# Altium schematic sheet 8_BTB.schdoc
size 210 x 148 mm; Symbol: tv_muban1_1; Company: 嘉立创EDA; Version: V1.0; Page Size: A4; @Project Name: LCEDAsucaiku; @Update Date: 2026-05-01; @Create Date: 2026-03-27; @Page Name: BTB; @Page Count: 8; @Page No: 8; @Update Time: 18:58:41; Color: #990000; Device: sucai_muban; @Board Name: tv基板; @Create Time: 22:25:07; @Schematic Name: Schematic1; @Assembly Variant: Basic; Border: 1; Title Block Position: 3; Size: A4; Width: 826; Height: 582; Region Start: 1; X Region Count: 6; Y Region Count: 4; Blade Width: 10; SheetNumber: 8; SheetTotal: 8
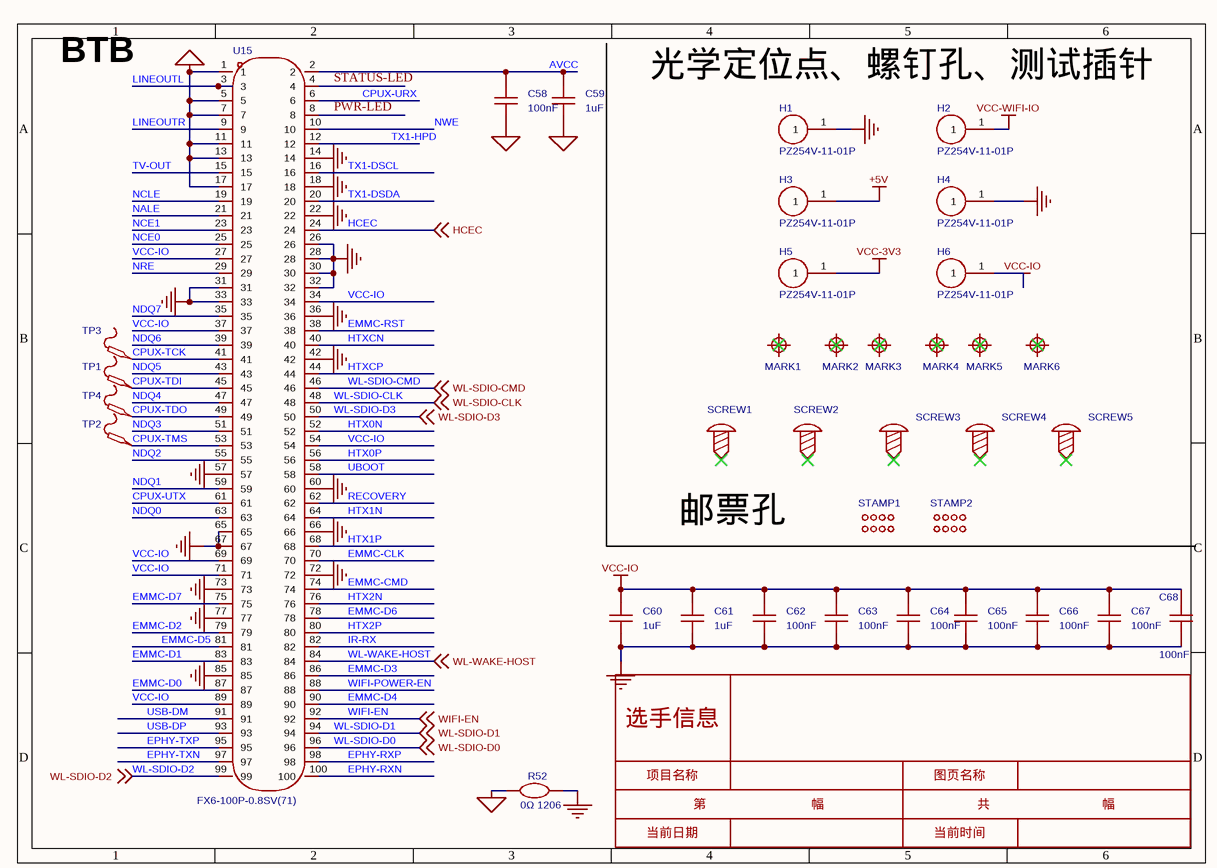
[diagram p0: 8_BTB.schdoc]

## Parts
C58  100nF  [C0402]
C59  1uF  [C0402]
C60  1uF  [C0402]
C61  1uF  [C0402]
C62  100nF  [C0402]
C63  100nF  [C0402]
C64  100nF  [C0402]
C65  100nF  [C0402]
C66  100nF  [C0402]
C67  100nF  [C0402]
C68  100nF  [C0402]
H1  PZ254V-11-01P  [HDR-TH_1P-P2.54-V-M]
H2  PZ254V-11-01P  [HDR-TH_1P-P2.54-V-M]
H3  PZ254V-11-01P  [HDR-TH_1P-P2.54-V-M]
H4  PZ254V-11-01P  [HDR-TH_1P-P2.54-V-M]
H5  PZ254V-11-01P  [HDR-TH_1P-P2.54-V-M]
H6  PZ254V-11-01P  [HDR-TH_1P-P2.54-V-M]
MARK1  (no value)  [Mark-Point-1mm]
MARK2  (no value)  [Mark-Point-1mm]
MARK3  (no value)  [Mark-Point-1mm]
MARK4  (no value)  [Mark-Point-1mm]
MARK5  (no value)  [Mark-Point-1mm]
MARK6  (no value)  [Mark-Point-1mm]
R52  0Ω 1206  [R1206]
SCREW1  (no value)  [SIP-1A]
SCREW2  (no value)  [SIP-1A]
SCREW3  (no value)  [SIP-1A]
SCREW4  (no value)  [SIP-1A]
SCREW5  (no value)  [SIP-1A]
STAMP1  (no value)  [youpiaokong]
STAMP2  (no value)  [youpiaokong]
TP1  (no value)  [Test-Point-0.5mm]
TP2  (no value)  [Test-Point-0.5mm]
TP3  (no value)  [Test-Point-0.5mm]
TP4  (no value)  [Test-Point-0.5mm]
U15  FX6-100P-0.8SV(71)  [CONN-SMD_100P-P0.80_FX6-100P-0.8SV71]

## Nets
+5V: H3.1
AGND: C58.2 C59.2 R52.1 U15.1 U15.5 U15.7 U15.11 U15.13 U15.17
GND: C60.2 C61.2 C62.2 C63.2 C64.2 C65.2 C66.2 C67.2 C68.2 H1.1 H4.1 R52.2 U15.14 U15.18 U15.22 U15.26 U15.28 U15.30 U15.31 U15.32 U15.33 U15.36 U15.42 U15.57 U15.60 U15.65 U15.66 U15.67 U15.72 U15.73 U15.77 U15.85
VCC-3V3: H5.1
VCC-IO: C60.1 C61.1 C62.1 C63.1 C64.1 C65.1 C66.1 C67.1 C68.1 H6.1 U15.27 U15.34 U15.37 U15.54 U15.69 U15.71 U15.89
VCC-WIFI-IO: H2.1
AVCC: C58.1 C59.1 U15.2
CPUX-TCK: TP3.1 U15.41
CPUX-TDI: TP1.1 U15.45
CPUX-TDO: TP4.1 U15.49
CPUX-TMS: TP2.1 U15.53
CPUX-URX: U15.6
CPUX-UTX: U15.61
EMMC-CLK: U15.70
EMMC-CMD: U15.74
EMMC-D0: U15.87
EMMC-D1: U15.83
EMMC-D2: U15.79
EMMC-D3: U15.86
EMMC-D4: U15.90
EMMC-D5: U15.81
EMMC-D6: U15.78
EMMC-D7: U15.75
EMMC-RST: U15.38
EPHY-RXN: U15.100
EPHY-RXP: U15.98
EPHY-TXN: U15.97
EPHY-TXP: U15.95
HCEC: U15.24 ; off-sheet HCEC
HTX0N: U15.52
HTX0P: U15.56
HTX1N: U15.64
HTX1P: U15.68
HTX2N: U15.76
HTX2P: U15.80
HTXCN: U15.40
HTXCP: U15.44
IR-RX: U15.82
LINEOUTL: U15.3
LINEOUTR: U15.9
NALE: U15.21
NCE0: U15.25
NCE1: U15.23
NCLE: U15.19
NDQ0: U15.63
NDQ1: U15.59
NDQ2: U15.55
NDQ3: U15.51
NDQ4: U15.47
NDQ5: U15.43
NDQ6: U15.39
NDQ7: U15.35
NRE: U15.29
NWE: U15.10
PWR-LED: U15.8
RECOVERY: U15.62
STATUS-LED: U15.4
TV-OUT: U15.15
TX1-DSCL: U15.16
TX1-DSDA: U15.20
TX1-HPD: U15.12
UBOOT: U15.58
USB-DM: U15.91
USB-DP: U15.93
WIFI-EN: U15.92 ; off-sheet WIFI-EN
WIFI-POWER-EN: U15.88
WL-SDIO-CLK: U15.48 ; off-sheet WL-SDIO-CLK
WL-SDIO-CMD: U15.46 ; off-sheet WL-SDIO-CMD
WL-SDIO-D0: U15.96 ; off-sheet WL-SDIO-D0
WL-SDIO-D1: U15.94 ; off-sheet WL-SDIO-D1
WL-SDIO-D2: U15.99 ; off-sheet WL-SDIO-D2
WL-SDIO-D3: U15.50 ; off-sheet WL-SDIO-D3
WL-WAKE-HOST: U15.84 ; off-sheet WL-WAKE-HOST

Not connected (* = marked no-connect by the designer): MARK1 1*; MARK2 1*; MARK3 1*; MARK4 1*; MARK5 1*; MARK6 1*; SCREW1 1*; SCREW2 1*; SCREW3 1*; SCREW4 1*; SCREW5 1*

## Notes on the sheet
- BTB
- (near H1) 光学定位点、螺钉孔、测试插针
- (near SCREW1) 邮票孔
- 选手信息
- 项目名称
- 第                              幅
- 图页名称
- 共                                幅
- 当前日期
- 当前时间

## Library data of the parts
C58 C62-C68 = CL05B104KO5NNNC: 容值:100nF;精度:±10%;额定电压:16V;温度系数:X7R;; Manufacturer: SAMSUNG(三星); 3D Model: 36a51122f27c49738f86b3bfa98863e0聨0819f05c4eef4c71ace90d822a990e87; 3D Model Transform: 39.37,19.685,0,0,0,0,0,0,0; Tolerance: ±10%; Voltage Rating: 16V; Temperature Coefficient: X7R; AddInBom: yes; ModelName: C0402_L1.0-W0.5-H0.5; Symbol: CL05B104KO5NNNC; Device: CL05B104KO5NNNC; LCSC Part Name: 100nF ±10% 16V; Supplier Part: C1525; Manufacturer Part: CL05B104KO5NNNC; Supplier Footprint: 0402; JLCPCB Part Class: Basic Part; Datasheet: https://item.szlcsc.com/datasheet/CL05B104KO5NNNC/1877.html; Supplier: LCSC; Value: 100nF; ConvertToPcb: yes; FootprintName: C0402
C59-C61 = CGA0402X5R105K500GT: 容值:1uF;精度:±10%;额定电压:50V;温度系数:X5R;; Manufacturer: HRE(芯声); 3D Model: 36a51122f27c49738f86b3bfa98863e0聨0819f05c4eef4c71ace90d822a990e87; 3D Model Transform: 39.37,19.685,0,0,0,0,0,0,0; Tolerance: ±10%; Voltage Rating: 50V; Temperature Coefficient: X5R; AddInBom: yes; ModelName: C0402_L1.0-W0.5-H0.5; Symbol: CGA0402X5R105K500GT; Device: CGA0402X5R105K500GT; LCSC Part Name: 1uF ±10% 50V; Supplier Part: C6119811; Manufacturer Part: CGA0402X5R105K500GT; Supplier Footprint: 0402; JLCPCB Part Class: Extended Part; Datasheet: https://item.szlcsc.com/datasheet/CGA0402X5R105K500GT/7062517.html; Supplier: LCSC; Value: 1uF; ConvertToPcb: yes; FootprintName: C0402
H1-H6 = PZ254V-11-01P: 插针结构:1x1P;间距:2.54mm;行距:-;圆针/方针:方针;安装方式:直插;排数:单排;总PIN位数:1P;额定电流:3A;额定电压:250V;配合针长度:6mm;塑高:2.5mm;端接针长度:3mm;触头材质:黄铜;触头镀层:-;工作温度:-40℃~+105℃;颜色:黑色;; Manufacturer: XFCN(兴飞); 3D Model: efa57846279b44bfa0a28253a2c74e33聨0819f05c4eef4c71ace90d822a990e87; 3D Model Transform: 100,100,0,0,0,0,0,0,-118.11; Pin Structure: 1x1P; Pitch: 2.54mm; Circluar Pins/Square Pins: 方针; Current Rating: 3A; Voltage Rating (Max): 250V; AddInBom: yes; ModelName: HDR2.54-M-LI-1X1P; Symbol: PZ254V-11-01P; Device: PZ254V-11-01P; LCSC Part Name: 1x1P 间距:2.54mm 方针 直插; Supplier Part: C492400; Manufacturer Part: PZ254V-11-01P; Supplier Footprint: 插件,P=2.54mm; JLCPCB Part Class: Extended Part; Datasheet: https://item.szlcsc.com/datasheet/PZ254V-11-01P/502956.html; Supplier: LCSC; Row Spacing: -; Mounting Type: 直插; Number of Rows: 单排; Number of Pins: 1P; Length of Mating Pin: 6mm; Insulation Height: 2.5mm; Length of End Connection Pin: 3mm; Contact Material: 黄铜; Contact Plating: -; Operating Temperature: -40℃~+105℃; Color: 黑色; ConvertToPcb: yes; FootprintName: HDR-TH_1P-P2.54-V-M
MARK1-MARK6 = Mark-Point: Mark点; AddInBom: no; ConvertToPcb: yes; Symbol: Mark-Point; Device: Mark-Point; FootprintName: Mark-Point-1mm
R52 = FRC1206P000 TS: 电阻类型:厚膜电阻;阻值:0Ω;精度:±5%;功率:250mW;工作电压:200V;; Manufacturer: FOJAN(富捷); 3D Model: 89a1f13db2384da588040e0b3c55bf66聨0819f05c4eef4c71ace90d822a990e87; 3D Model Transform: 125.984,62.992,0,0,0,0,0,0,0; Tolerance: ±5%; Power(Watts): 250mW; Voltage-Supply(Max): 200V; AddInBom: yes; ModelName: R1206_L3.2-W1.6-H0.6; Symbol: FRC1206P000 TS; Device: FRC1206P000 TS; Value: 0Ω 1206; LCSC Part Name: 0Ω ±5% 250mW 厚膜电阻; Manufacturer Part: FRC1206P000 TS; Supplier Footprint: 1206; JLCPCB Part Class: Extended Part; Supplier: LCSC; Type: 厚膜电阻; Operating Temperature: -55℃~+155℃; ConvertToPcb: yes; FootprintName: R1206
SCREW1-SCREW5 = M3螺丝: Symbol: 螺丝孔; ConvertToPcb: yes; Device: M3螺丝; Supplier Footprint: 插件; AddInBom: yes; FootprintName: SIP-1A
STAMP1 STAMP2 = youpiaokong: AddInBom: yes; Symbol: youpiaokong; Device: youpiaokong; FootprintName: youpiaokong; ConvertToPcb: yes
TP1-TP4 = Test-Point: Test Point 测试点; AddInBom: yes; Symbol: Test-Point; Device: Test-Point; ConvertToPcb: yes; FootprintName: Test-Point-0.5mm
U15 = FX6-100P-0.8SV(71): 额定电流:500mA;工作温度:-55℃~+85℃;; Manufacturer: HRS(广濑); 3D Model: 2760271e6f4b4f45910819c2043a6dc4聨0819f05c4eef4c71ace90d822a990e87; 3D Model Transform: 1881.886,224.409,0,0,0,0,-0.002,-0.004,-27.559; Current Rating: 500mA; Voltage Rating: 100V; AddInBom: yes; Symbol: FX6-100P-0.8SV(71); Device: FX6-100P-0.8SV(71); LCSC Part Name: FX6-100P-0.8SV(71); Supplier Part: C5121467; Manufacturer Part: FX6-100P-0.8SV(71); Supplier Footprint: SMD-100P; JLCPCB Part Class: Extended Part; Datasheet: https://item.szlcsc.com/datasheet/FX6-100P-0.8SV(71)/5709403.html; Supplier: LCSC; Operating Temperature: -55℃~+85℃; ConvertToPcb: yes; FootprintName: CONN-SMD_100P-P0.80_FX6-100P-0.8SV71; ModelName: CONN-SMD_100P-P0.80_FX6-100P-0.8SV71